# Altium schematic sheet dual_header_card_60_100.SchDoc: PCI Express Mini 52Pin
size OrCAD B
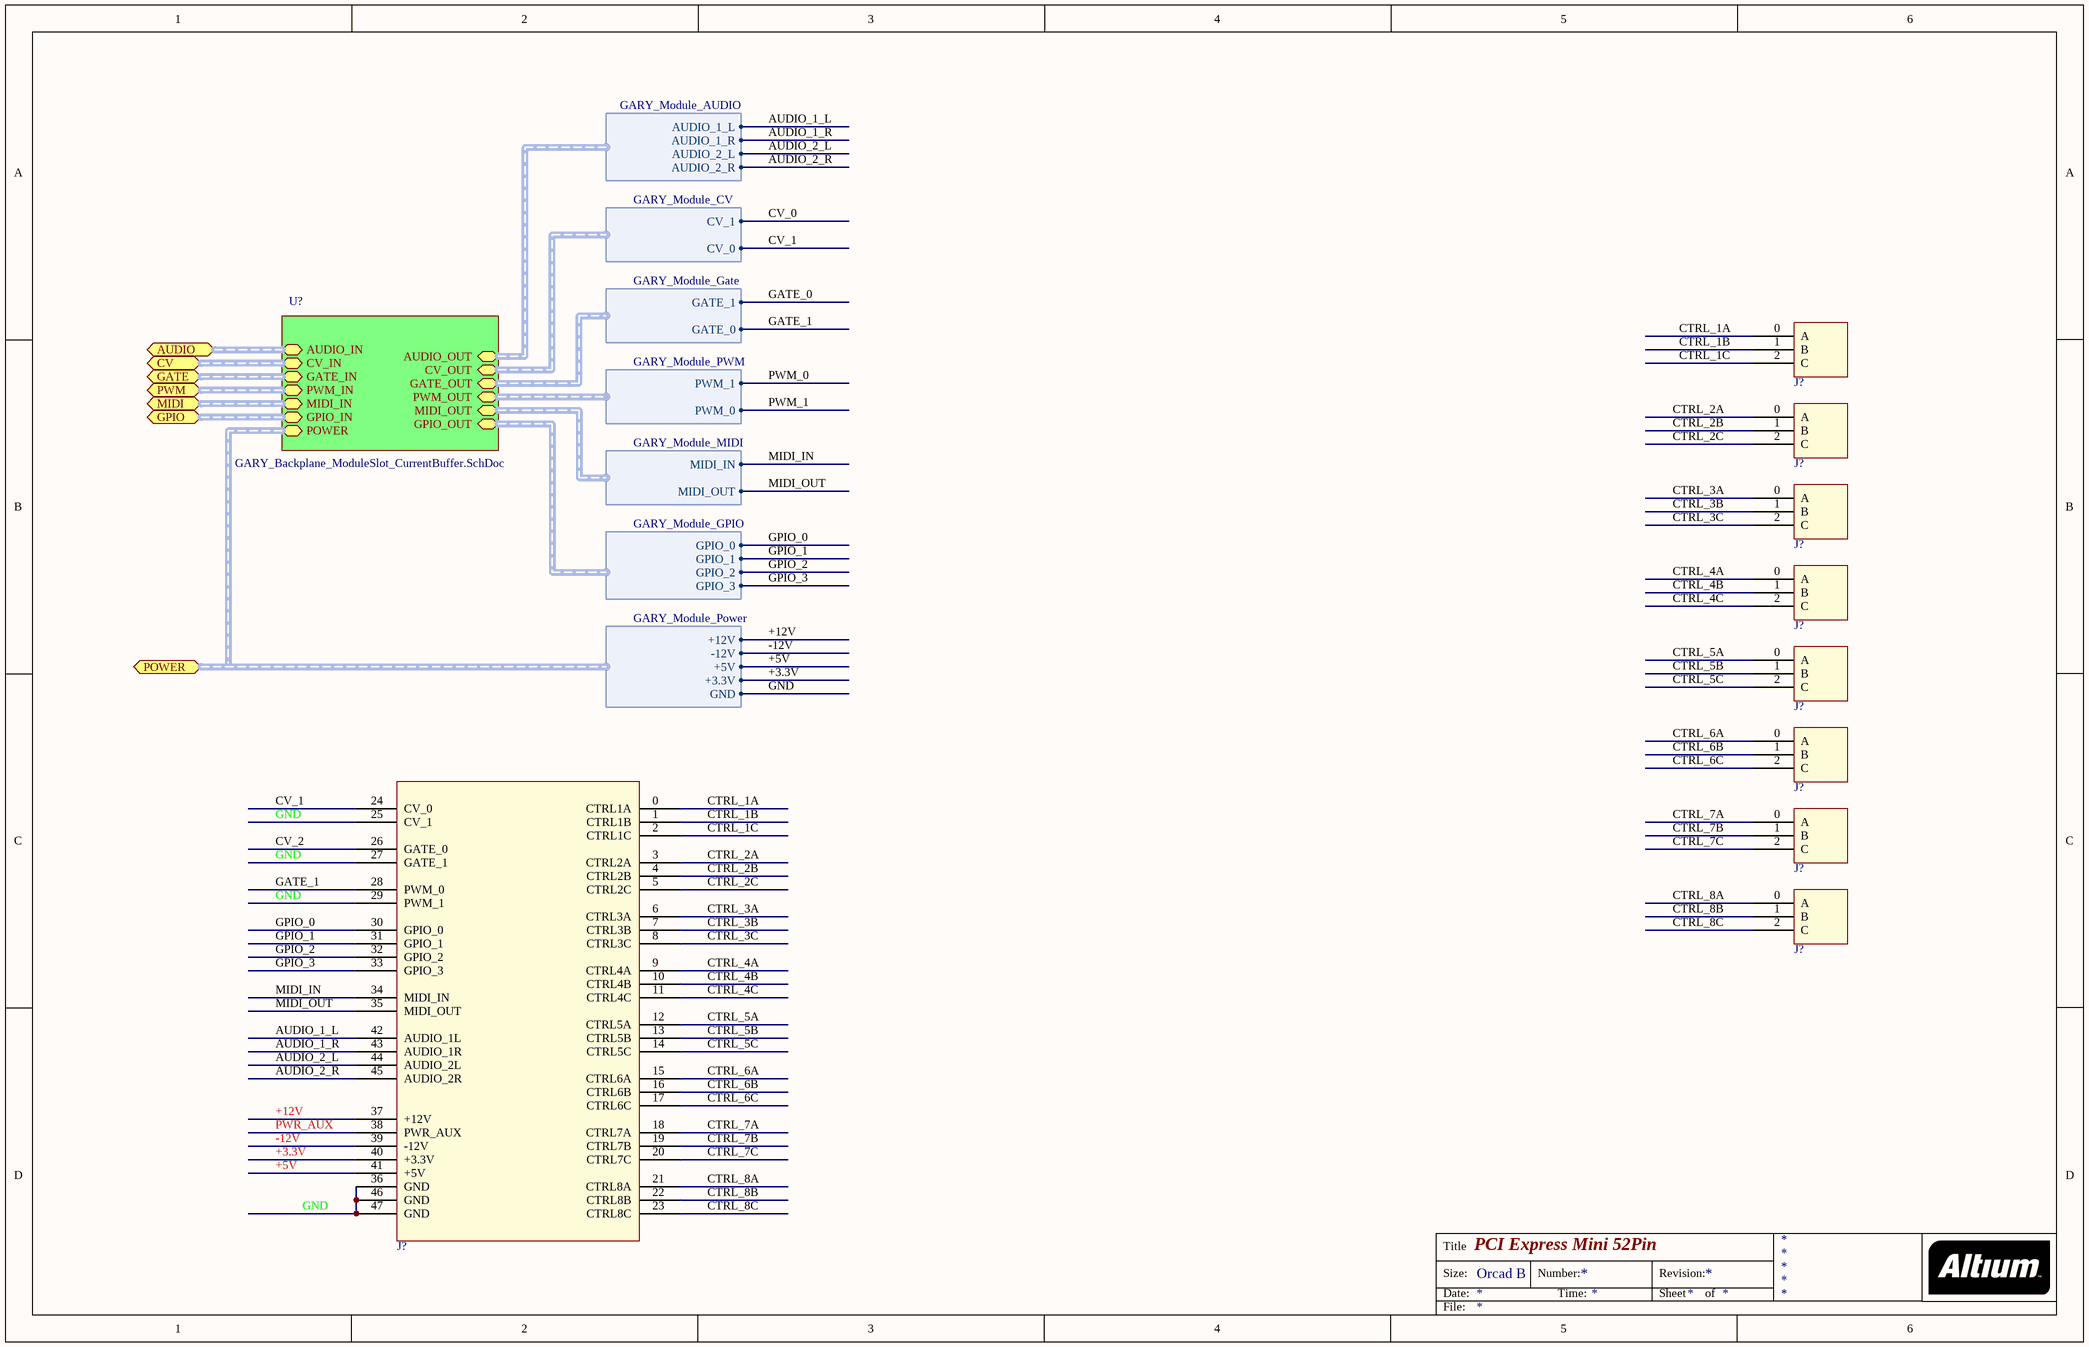
[diagram p0: dual_header_card_60_100.SchDoc]

## Parts
(Parts that share a designator on the sheet are numbered #1, #2 ... from top to bottom, then left to right.)
J?#1  CTRL_INPUT_Generic  [CTRL_INPUT]  (value not drawn)
J?#2  CTRL_INPUT_Generic  [CTRL_INPUT]  (value not drawn)
J?#3  CTRL_INPUT_Generic  [CTRL_INPUT]  (value not drawn)
J?#4  CTRL_INPUT_Generic  [CTRL_INPUT]  (value not drawn)
J?#5  CTRL_INPUT_Generic  [CTRL_INPUT]  (value not drawn)
J?#6  CTRL_INPUT_Generic  [CTRL_INPUT]  (value not drawn)
J?#7  CTRL_INPUT_Generic  [CTRL_INPUT]  (value not drawn)
J?#8  CTRL_INPUT_Generic  [CTRL_INPUT]  (value not drawn)
J?#9  MODULE  [MODULE]  (value not drawn)

## Sub-sheets
U? = GARY_Backplane_ModuleSlot_CurrentBuffer.SchDoc: CV_IN (harness GARY_Module_CV), GATE_IN (harness GARY_Module_Gate), PWM_IN (harness GARY_Module_PWM), MIDI_IN (harness GARY_Module_MIDI), GPIO_IN (harness GARY_Module_MIDI), CV_OUT (harness GARY_Module_CV), GATE_OUT (harness GARY_Module_Gate), PWM_OUT (harness GARY_Module_PWM), MIDI_OUT (harness GARY_Module_MIDI), GPIO_OUT (harness GARY_Module_GPIO), POWER (harness GARY_Module_Power), AUDIO_IN (harness GARY_Module_AUDIO), AUDIO_OUT (harness GARY_Module_AUDIO)

## Ports
AUDIO (harness GARY_Module_AUDIO), CV (harness GARY_Module_CV), GATE (harness GARY_Module_Gate), GPIO (harness GARY_Module_GPIO), MIDI (harness GARY_Module_MIDI), POWER (harness GARY_Module_Power), PWM (harness GARY_Module_PWM)

## Harnesses
GARY_Module_Power: +12V, +5V, GND, +3.3V, -12V
GARY_Module_MIDI: MIDI_IN, MIDI_OUT
GARY_Module_GPIO: GPIO_0, GPIO_1, GPIO_2, GPIO_3
GARY_Module_PWM: PWM_0, PWM_1
GARY_Module_CV: CV_0, CV_1
GARY_Module_Gate: GATE_0, GATE_1
GARY_Module_AUDIO: AUDIO_1_L, AUDIO_1_R, AUDIO_2_R, AUDIO_2_L

## Nets
+3.3V: J?#9.40(+3.3V) ; port POWER.+3.3V
+5V: J?#9.41(+5V) ; port POWER.+5V
+12V: J?#9.37(+12V) ; port POWER.+12V
-12V: J?#9.39(-12V) ; port POWER.-12V
AUDIO_1_L: J?#9.42(AUDIO_1L) ; sheet U?/AUDIO_OUT.AUDIO_1_L
AUDIO_1_R: J?#9.43(AUDIO_1R) ; sheet U?/AUDIO_OUT.AUDIO_1_R
AUDIO_2_L: J?#9.44(AUDIO_2L) ; sheet U?/AUDIO_OUT.AUDIO_2_L
AUDIO_2_R: J?#9.45(AUDIO_2R) ; sheet U?/AUDIO_OUT.AUDIO_2_R
CTRL_1A: J?#1.0(A) J?#9.0(CTRL1A)
CTRL_1B: J?#1.1(B) J?#9.1(CTRL1B)
CTRL_1C: J?#1.2(C) J?#9.2(CTRL1C)
CTRL_2A: J?#2.0(A) J?#9.3(CTRL2A)
CTRL_2B: J?#2.1(B) J?#9.4(CTRL2B)
CTRL_2C: J?#2.2(C) J?#9.5(CTRL2C)
CTRL_3A: J?#3.0(A) J?#9.6(CTRL3A)
CTRL_3B: J?#3.1(B) J?#9.7(CTRL3B)
CTRL_3C: J?#3.2(C) J?#9.8(CTRL3C)
CTRL_4A: J?#4.0(A) J?#9.9(CTRL4A)
CTRL_4B: J?#4.1(B) J?#9.10(CTRL4B)
CTRL_4C: J?#4.2(C) J?#9.11(CTRL4C)
CTRL_5A: J?#5.0(A) J?#9.12(CTRL5A)
CTRL_5B: J?#5.1(B) J?#9.13(CTRL5B)
CTRL_5C: J?#5.2(C) J?#9.14(CTRL5C)
CTRL_6A: J?#6.0(A) J?#9.15(CTRL6A)
CTRL_6B: J?#6.1(B) J?#9.16(CTRL6B)
CTRL_6C: J?#6.2(C) J?#9.17(CTRL6C)
CTRL_7A: J?#7.0(A) J?#9.18(CTRL7A)
CTRL_7B: J?#7.1(B) J?#9.19(CTRL7B)
CTRL_7C: J?#7.2(C) J?#9.20(CTRL7C)
CTRL_8A: J?#8.0(A) J?#9.21(CTRL8A)
CTRL_8B: J?#8.1(B) J?#9.22(CTRL8B)
CTRL_8C: J?#8.2(C) J?#9.23(CTRL8C)
CV_0: sheet U?/CV_OUT.CV_1
CV_1: J?#9.24(CV_0) ; sheet U?/CV_OUT.CV_0
CV_2: J?#9.26(GATE_0)
GATE_0: sheet U?/GATE_OUT.GATE_1
GATE_1: J?#9.28(PWM_0) ; sheet U?/GATE_OUT.GATE_0
GND: J?#9.25(CV_1) J?#9.27(GATE_1) J?#9.29(PWM_1) J?#9.36(GND) J?#9.46(GND) J?#9.47(GND) ; port POWER.GND
GPIO_0: J?#9.30(GPIO_0) ; sheet U?/GPIO_OUT.GPIO_0
GPIO_1: J?#9.31(GPIO_1) ; sheet U?/GPIO_OUT.GPIO_1
GPIO_2: J?#9.32(GPIO_2) ; sheet U?/GPIO_OUT.GPIO_2
GPIO_3: J?#9.33(GPIO_3) ; sheet U?/GPIO_OUT.GPIO_3
MIDI_IN: J?#9.34(MIDI_IN) ; sheet U?/MIDI_OUT.MIDI_IN
MIDI_OUT: J?#9.35(MIDI_OUT) ; sheet U?/MIDI_OUT.MIDI_OUT
PWM_0: sheet U?/PWM_OUT.PWM_1
PWM_1: sheet U?/PWM_OUT.PWM_0
PWR_AUX: J?#9.38(PWR_AUX)

## Buses and harness runs
harness port AUDIO = sheet U?/AUDIO_IN
harness port CV = sheet U?/CV_IN
harness port GATE = sheet U?/GATE_IN
harness port GPIO = sheet U?/GPIO_IN
harness port MIDI = sheet U?/MIDI_IN
harness port POWER = sheet U?/POWER
harness port PWM = sheet U?/PWM_IN

## Notes on the sheet
- Title
- Size:
- Date:
- Orcad B
- Number:
- Time:
- Revision:
- Sheet
- of
- File:

## Library data of the parts
J?#1-J?#8 = CTRL_INPUT_Generic: GARY Synthesizer - Generic Control Input
J?#9 = MODULE: GARY Synthesizer - Module Footprint